# EAGLE design me433_test (EAGLE 8.1.0)
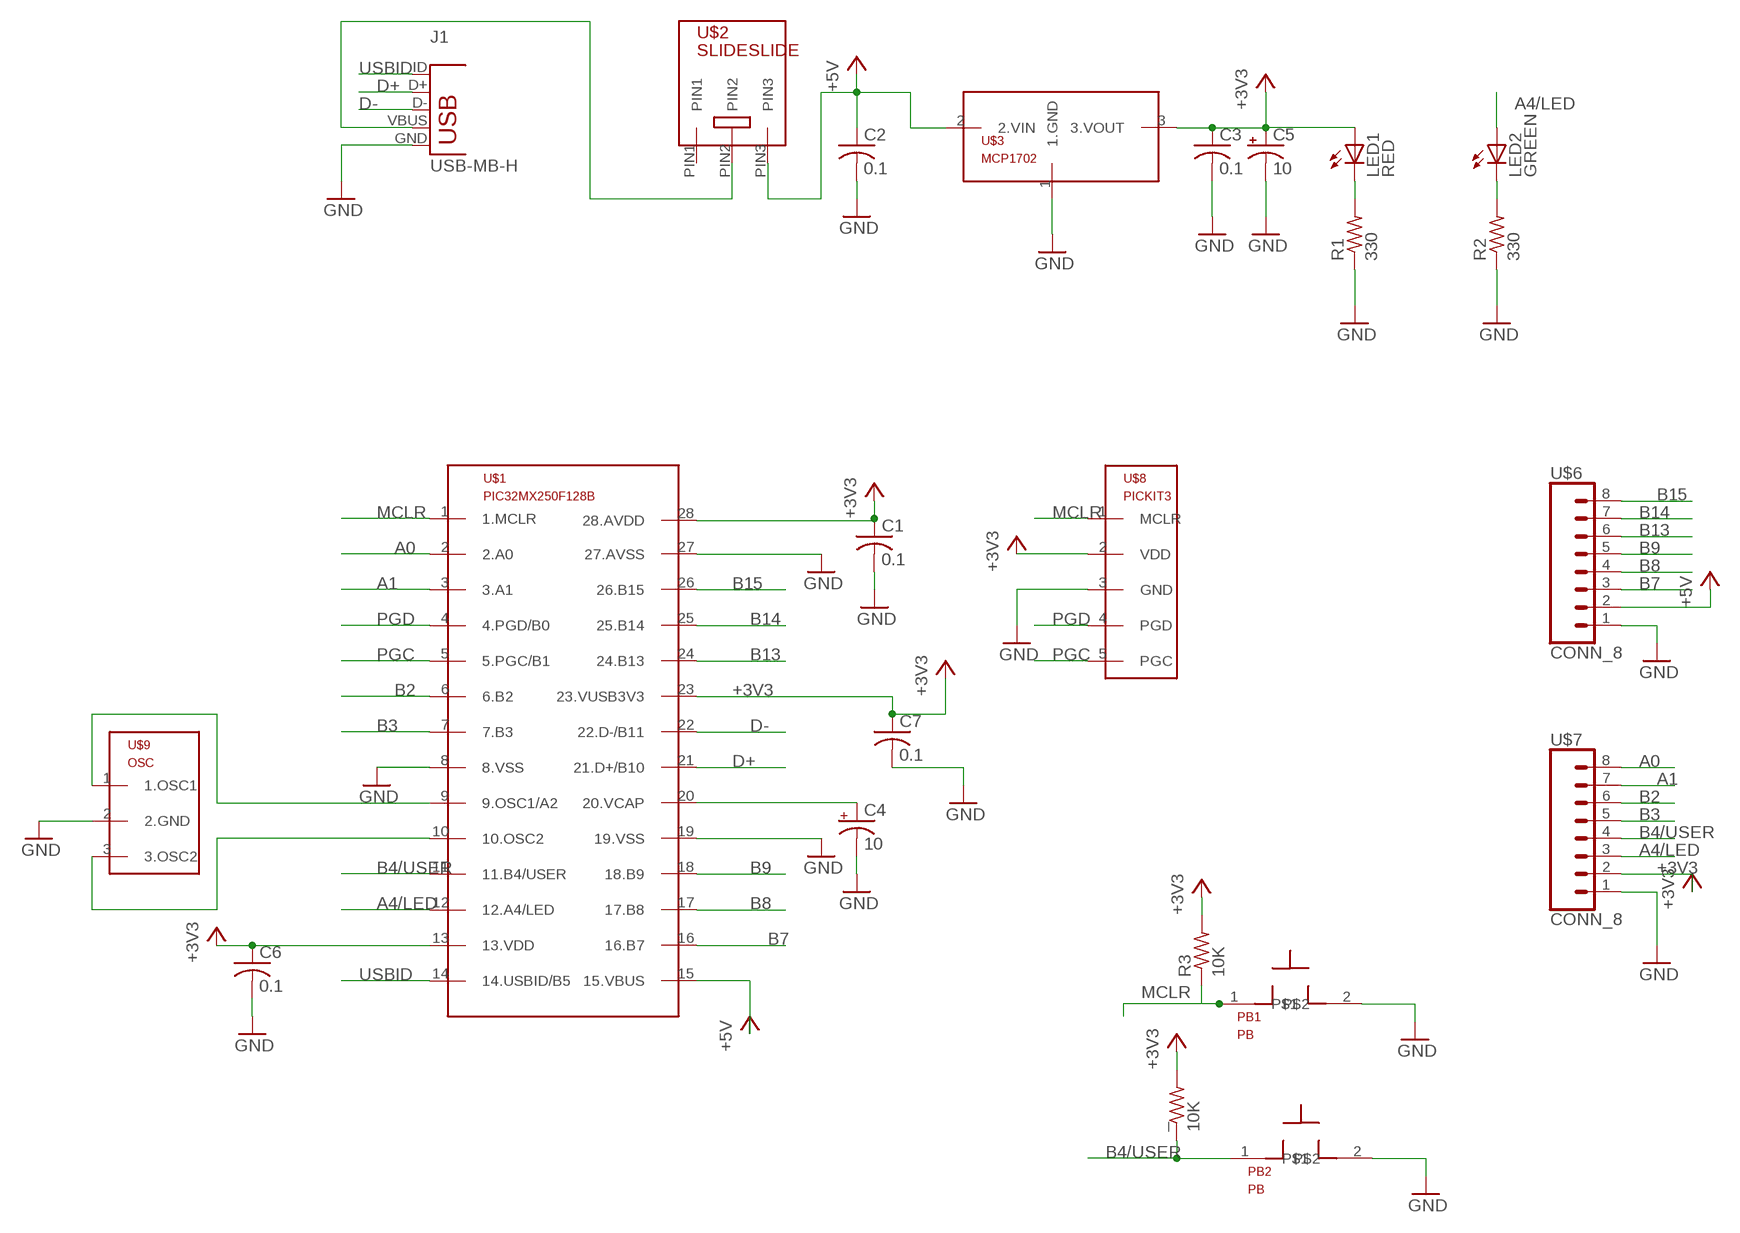
[diagram p0: schematic, sheet 1]

## Parts
_  10K  R-US_0207/10  [0207/10]
C1  0.1  C-US025-025X050  [C025-025X050]
C2  0.1  C-US025-025X050  [C025-025X050]
C3  0.1  C-US025-025X050  [C025-025X050]
C4  10  CPOL-USB45181B  [B45181B]
C5  10  CPOL-USB45181B  [B45181B]
C6  0.1  C-US025-025X050  [C025-025X050]
C7  0.1  C-US025-025X050  [C025-025X050]
J1  USB-MB-H  [USB-MB-H]
LED1  RED  LED3MM  [LED3MM]
LED2  GREEN  LED3MM  [LED3MM]
PB1  PB  [PB]
PB2  PB  [PB]
R1  330  R-US_0207/10  [0207/10]
R2  330  R-US_0207/10  [0207/10]
R3  10K  R-US_0207/10  [0207/10]
U$1  PIC32MX250F128B  [DIL28-3]
U$2  SLIDESLIDE  [SLIDE]
U$3  MCP1702  [TO92]
U$6  CONN_8  [1X08]
U$7  CONN_8  [1X08]
U$8  PICKIT3  [1X05]
U$9  OSC  [OSC]

## Nets
+3V3: _.2 C1.1 C3.1 C5.+ C6.1 C7.1 LED1.A R3.2 U$1.13(13.VDD) U$1.23(23.VUSB3V3) U$1.28(28.AVDD) U$3.3(3.VOUT) U$7.2 U$8.2(VDD)
+5V: C2.1 U$1.15(15.VBUS) U$2.PIN3 U$3.2(2.VIN) U$6.2
A0: U$1.2(2.A0) U$7.8
A1: U$1.3(3.A1) U$7.7
A4/LED: LED2.A U$1.12(12.A4/LED) U$7.3
B2: U$1.6(6.B2) U$7.6
B3: U$1.7(7.B3) U$7.5
B4/USER: _.1 PB2.1 U$1.11(11.B4/USER) U$7.4
B7: U$1.16(16.B7) U$6.3
B8: U$1.17(17.B8) U$6.4
B9: U$1.18(18.B9) U$6.5
B13: U$1.24(24.B13) U$6.6
B14: U$1.25(25.B14) U$6.7
B15: U$1.26(26.B15) U$6.8
D+: J1.D+ U$1.21(21.D+/B10)
D-: J1.D- U$1.22(22.D-/B11)
GND: C1.2 C2.2 C3.2 C4.- C5.- C6.2 C7.2 J1.GND PB1.2 PB2.2 R1.1 R2.1 U$1.8(8.VSS) U$1.19(19.VSS) U$1.27(27.AVSS) U$3.1(1.GND) U$6.1 U$7.1 U$8.3(GND) U$9.2(2.GND)
MCLR: PB1.1 R3.1 U$1.1(1.MCLR) U$8.1(MCLR)
N$1: U$1.9(9.OSC1/A2) U$9.1(1.OSC1)
N$2: U$1.10(10.OSC2) U$9.3(3.OSC2)
N$3: J1.VBUS U$2.PIN2
N$4: C4.+ U$1.20(20.VCAP)
N$6: LED1.K(C) R1.2
N$7: LED2.K(C) R2.2
PGC: U$1.5(5.PGC/B1) U$8.5(PGC)
PGD: U$1.4(4.PGD/B0) U$8.4(PGD)
USBID: J1.ID U$1.14(14.USBID/B5)
Unconnected: U$2.PIN1

## Library data of the parts
_ R1-R3 = me433_lib:R-US_: RESISTOR, American symbol
C1-C3 C6 C7 = me433_lib:C-US: CAPACITOR, American symbol
C4 C5 = me433_lib:CPOL-US: POLARIZED CAPACITOR, American symbol
J1 = me433_lib:USB: USB Connectors USB-B-PTH is fully proven SKU : PRT-00139/CONN-08278 USB-miniB is fully proven SKU : PRT-00587 USB-A-PCB is untested. USB-A-H is throughly reviewed, but untested. Spark Fun Electronics SKU : PRT-00437 USB-B-SMT is throughly reviewed, but untested. Needs silkscreen touching up. USB-A-S has not been used/tested USB-MB-H has not been used/tested USB-MICROB has been used. CONN-09505
LED1 LED2 = led:LED: LED OSRAM: - CHIPLED LG R971, LG N971, LY N971, LG Q971, LY Q971, LO R971, LY R971 LH N974, LH R974 LS Q976, LO Q976, LY Q976 LO Q996 - Hyper CHIPLED LW Q18S LB Q993, LB Q99A, LB R99A - SideLED LS A670, LO A670, LY A670, LG A670, LP A670 LB A673, LV A673, LT A673, LW A673 LH A674 LY A675 LS A676, LA A676, LO A676, LY A676, LW A676 LS A679, LY A679, LG A679 - Hyper Micro SIDELED® LS Y876, LA Y876, LO Y876, LY Y876 LT Y87S - SmartLED LW L88C, LW L88S LB L89C, LB L89S, LG L890 LS L89K, LO L89K, LY L89K LS L896, LA L896, LO L896, LY L896 - TOPLED LS T670, LO T670, LY T670, LG T670, LP T670 LSG T670, LSP T670, LSY T670, LOP T670, LYG T670 LG T671, LOG T671, LSG T671 LB T673, LV T673, LT T673, LW T673 LH T674 LS T676, LA T676, LO T676, LY T676, LB T676, LH T676, LSB T676, LW T676 LB T67C, LV T67C, LT T67C, LS T67K, LO T67K, LY T67K, LW E67C LS E67B, LA E67B, LO E67B, LY E67B, LB E67C, LV E67C, LT E67C LW T67C LS T679, LY T679, LG T679 LS T770, LO T770, LY T770, LG T770, LP T770 LB T773, LV T773, LT T773, LW T773 LH T774 LS E675, LA E675, LY E675, LS T675 LS T776, LA T776, LO T776, LY T776, LB T776 LHGB T686 LT T68C, LB T68C - Hyper Mini TOPLED® LB M676 - Mini TOPLED Santana® LG M470 LS M47K, LO M47K, LY M47K Source: http://www.osram.convergy.de LUXEON: - LUMILED® LXK2-PW12-R00, LXK2-PW12-S00, LXK2-PW14-U00, LXK2-PW14-V00 LXK2-PM12-R00, LXK2-PM12-S00, LXK2-PM14-U00 LXK2-PE12-Q00, LXK2-PE12-R00, LXK2-PE12-S00, LXK2-PE14-T00, LXK2-PE14-U00 LXK2-PB12-K00, LXK2-PB12-L00, LXK2-PB12-M00, LXK2-PB14-N00, LXK2-PB14-P00, LXK2-PB14-Q00 LXK2-PR12-L00, LXK2-PR12-M00, LXK2-PR14-Q00, LXK2-PR14-R00 LXK2-PD12-Q00, LXK2-PD12-R00, LXK2-PD12-S00 LXK2-PH12-R00, LXK2-PH12-S00 LXK2-PL12-P00, LXK2-PL12-Q00, LXK2-PL12-R00 Source: www.luxeon.com KINGBRIGHT: KA-3528ASYC Source: www.kingbright.com
PB1 PB2 = me433_lib:PB
U$1 = me433_lib:PIC32MX250F128B
U$2 = me433_lib:SLIDE
U$3 = me433_lib:MCP1702
U$6 U$7 = me433_lib:CONN_8
U$8 = me433_lib:PICKIT3
U$9 = me433_lib:OSC

## Board
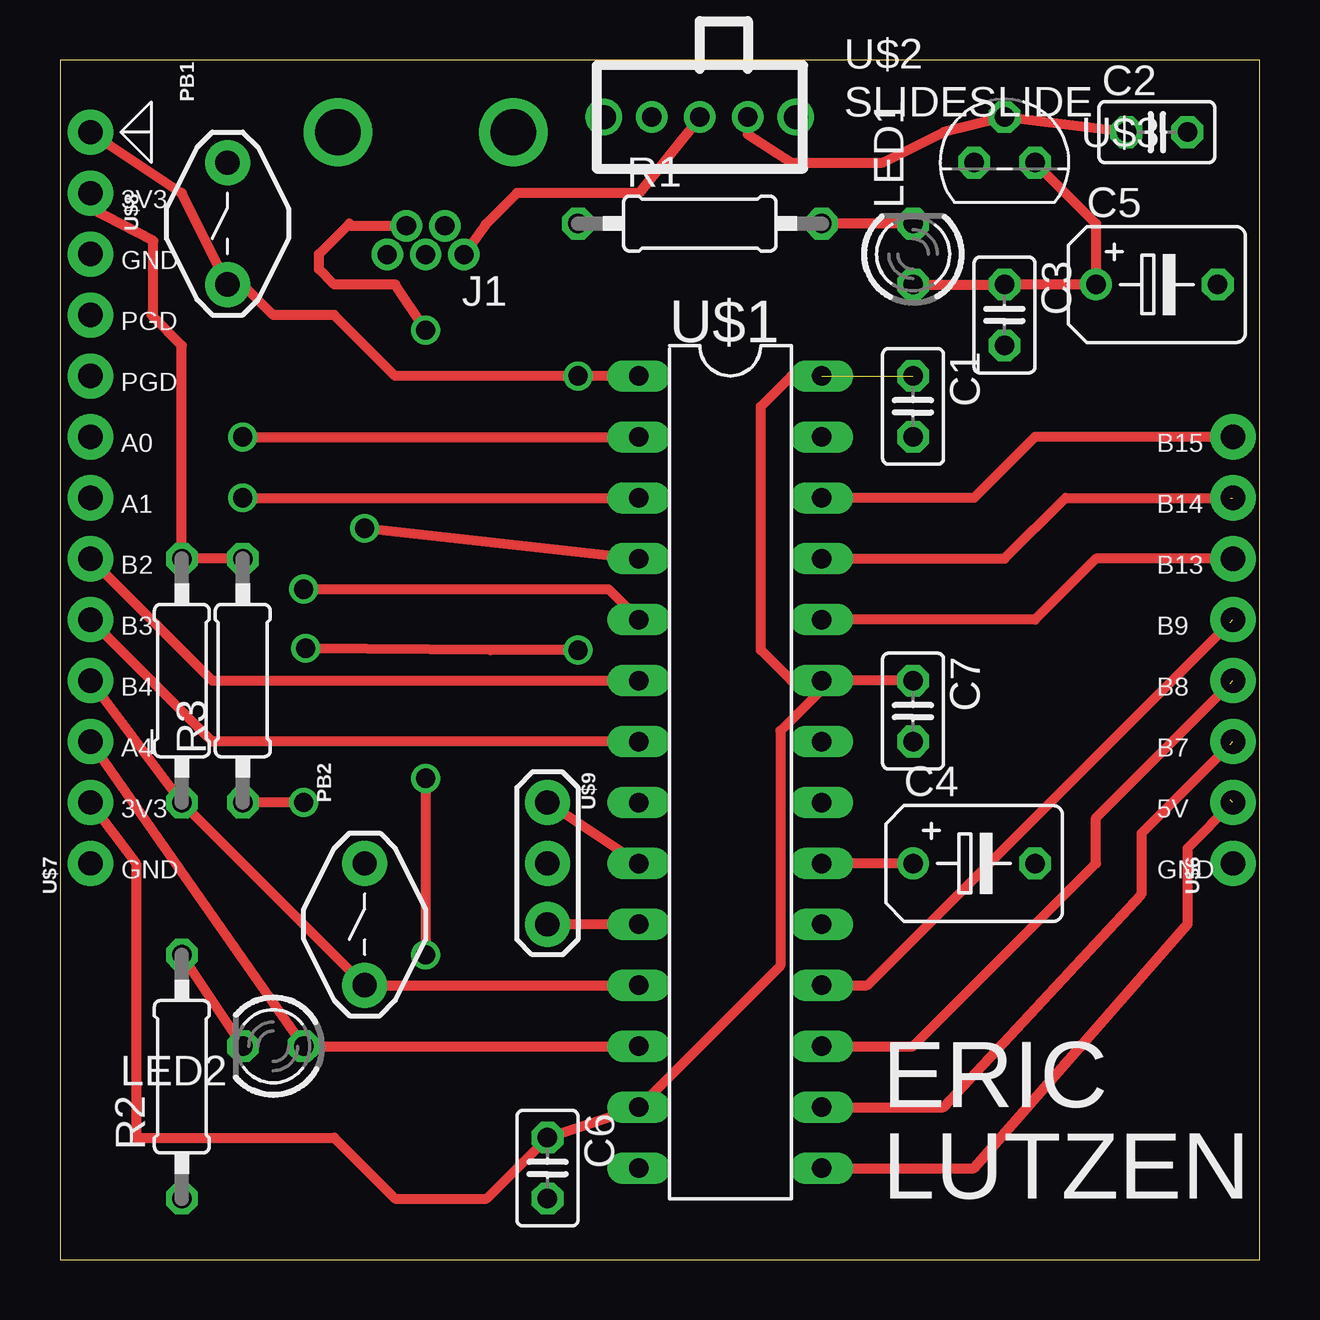
[diagram p1: board, top side]
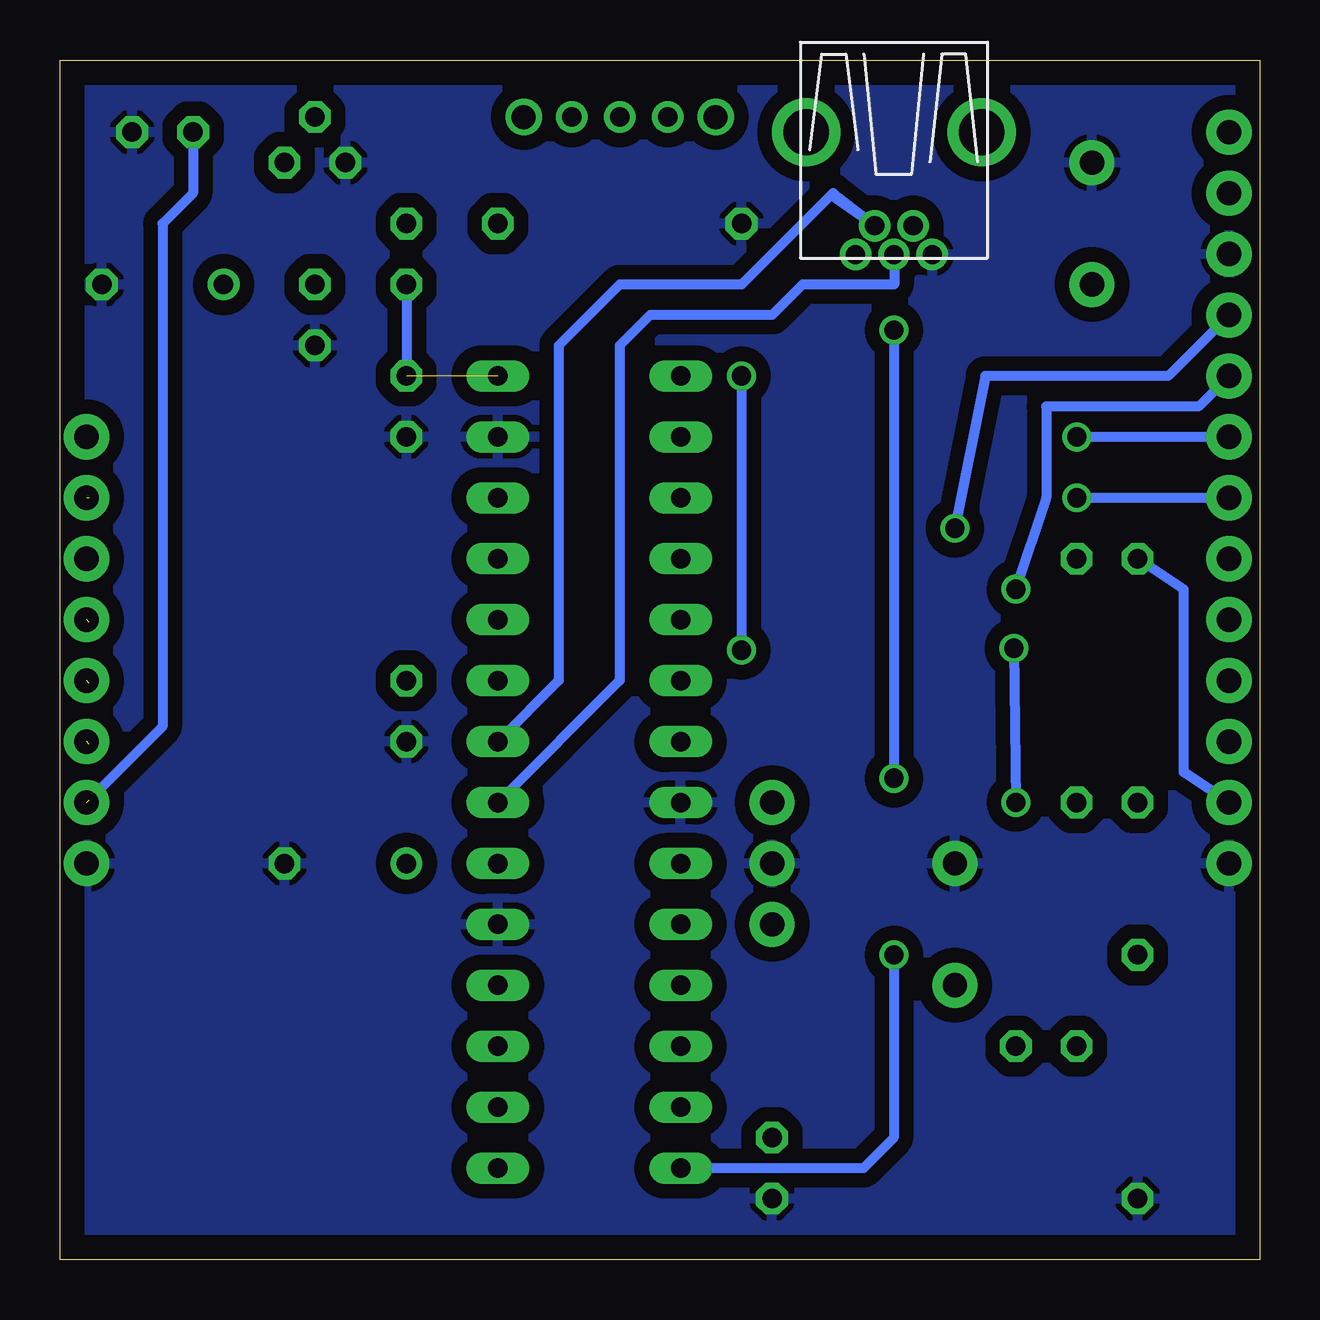
[diagram p2: board, bottom side, seen from below]

Size 50 x 50 mm. Coordinates in mm from the lower left corner, seen from the top.
Outline: 0,0 50,0 50,50 0,50 0,0
Copper layers (1*16): Top 0.035mm / dielectric 1.5mm / Bottom 0.035mm
Design rules "default": minimum track width 10mil, minimum drill 24mil, track to track 8mil, track to pad 8mil, pad to pad 8mil, via to via 8mil, smd to smd 8mil, copper to edge 40mil, drill to drill 8mil, minimum pad ring 10mil, minimum via ring 8mil, stop-mask expansion 4mil, vias tented up to drill 0mil, thermal gap 10mil

### Footprints (pad centres in the part's own frame; a part is rotated, then mirrored left to right if it is on the bottom)
0207/10 = drill 0.813 octagon: 1 -5.08,0; 2 5.08,0
C025-025X050 = drill 0.813 octagon: 1 -1.27,0; 2 1.27,0
B45181B = drill 0.813: + -2.54,0 | drill 0.813 octagon: - 2.54,0
USB-MB-H = drill 0.8: D+ 5.1,0; D- 3.9,0.8; GND 5.1,-1.6; ID 3.9,-0.8; VBUS 5.1,1.6 | drill 1.9: P$6 0,-3.65; P$7 0,3.65
LED3MM = drill 0.813 octagon: A -1.27,0; K 1.27,0
PB = drill 1.016 pad 1.88: 1 -2.54,0; 2 2.54,0
DIL28-3 = drill 0.813 long: 1 -16.51,-3.81; 2 -13.97,-3.81; 3 -11.43,-3.81; 4 -8.89,-3.81; 5 -6.35,-3.81; 6 -3.81,-3.81; 7 -1.27,-3.81; 8 1.27,-3.81; 9 3.81,-3.81; 10 6.35,-3.81; 11 8.89,-3.81; 12 11.43,-3.81; 13 13.97,-3.81; 14 16.51,-3.81; 15 16.51,3.81; 16 13.97,3.81; 17 11.43,3.81; 18 8.89,3.81; 19 6.35,3.81; 20 3.81,3.81; 21 1.27,3.81; 22 -1.27,3.81; 23 -3.81,3.81; 24 -6.35,3.81; 25 -8.89,3.81; 26 -11.43,3.81; 27 -13.97,3.81; 28 -16.51,3.81
SLIDE = drill 1: P$4 -4,0; P$5 4,0 | drill 0.8: PIN1 -2,0; PIN2 0,0; PIN3 2,0
TO92 = drill 0.813 octagon: 1 -1.27,0; 2 0,1.905; 3 1.27,0
1X08 = drill 1.016 pad 1.88: 1 0,0; 2 2.54,0; 3 5.08,0; 4 7.62,0; 5 10.16,0; 6 12.7,0; 7 15.24,0; 8 17.78,0
1X05 = drill 1.016 pad 1.88: 1 0,0; 2 2.54,0; 3 5.08,0; 4 7.62,0; 5 10.16,0
OSC = drill 1.016 pad 1.88: 1 -2.54,0; 2 0,0; 3 2.54,0

### Placement (x,y rotation side)
_  5.08,24.13 90 top
C1  35.56,35.56 270 top
C2  45.72,46.99 0 top
C3  39.37,39.37 270 top
C4  38.1,16.51 0 top
C5  45.72,40.64 0 top
C6  20.32,3.81 270 top
C7  35.56,22.86 270 top
J1  15.24,46.99 270 top
LED1  35.56,41.91 90 top
LED2  8.89,8.89 180 top
PB1  6.99,43.18 90 top
PB2  12.7,13.97 90 top
R1  26.67,43.18 0 top
R2  5.08,7.62 90 top
R3  7.62,24.13 90 top
U$1  27.94,20.32 270 top
U$2  26.67,47.62 0 top
U$3  39.37,45.72 0 top
U$6  48.9,16.51 90 top
U$7  1.27,16.51 90 top
U$8  1.27,46.99 270 top
U$9  20.32,16.51 270 top

### Tracks (layer width: path | path; a pad name or v marks a point on that pad's centre or on a via)
+3V3  (1 unrouted)
  Top 0.406: U$3.3 43.18,43.18 C5.+ C3.1 LED1.A | C7.1 U$1.23 | U$1.28 30.48,36.83 29.21,35.56 29.21,25.4 30.48,24.13 U$1.23 | R3.2 _.2 5.08,38.1 3.89,39.29 | U$7.2 3.17,16.51 3.17,5.08 11.43,5.08 13.97,2.54 17.78,2.54 C6.1 U$1.13 30.02,12.24 30.02,22.03 31.75,23.76 U$1.23 | 3.81,39.37 3.89,39.29 | U$8.2 1.27,43.81 3.89,42.47 3.89,39.29
  Bottom 0.406: LED1.A C1.1 | _.2 3.17,27.94 3.17,20.32 U$7.2
+5V  (1 unrouted)
  Top 0.406: U$2.PIN3 28.67,46.9 30.48,45.72 34.29,45.72 36.83,46.99 U$3.2 C2.1 | U$1.15 38.1,3.81 46.99,13.97 46.99,17.14 U$6.2
  Bottom 0.406: C2.1 44.45,44.45 45.72,43.18 45.72,22.23 48.78,19.16
A0  (via drill 0.8 pad 0.81)
  Top 0.406: v7.62,34.29 U$1.2
  Bottom 0.406: U$7.8 v7.62,34.29
A1  (via drill 0.8 pad 0.81)
  Top 0.406: v7.62,31.75 U$1.3
  Bottom 0.406: U$7.7 v7.62,31.75
A4/LED
  Top 0.406: U$1.12 LED2.A U$7.3
B2
  Top 0.406: U$7.6 6.35,24.13 U$1.6
B3
  Top 0.406: U$7.5 6.35,21.59 U$1.7
B4/USER
  Top 0.406: U$7.4 _.1 PB2.1 U$1.11
B7  (1 unrouted)
  Top 0.406: U$1.16 36.83,6.35 45.09,15.24 45.09,17.78 48.78,21.48
B8  (1 unrouted)
  Top 0.406: U$1.17 35.56,8.89 43.18,16.51 43.18,18.41 48.78,24.02
B9  (1 unrouted)
  Top 0.406: U$1.18 33.66,11.43 48.78,26.56
B13
  Top 0.406: U$6.6 43.18,29.21 40.64,26.67 U$1.24
B14  (1 unrouted)
  Top 0.406: U$1.25 39.37,29.21 41.91,31.75 48.78,31.75
B15
  Top 0.406: U$6.8 40.64,34.29 38.1,31.75 U$1.26
D+
  Bottom 0.406: U$1.21 26.67,24.13 26.67,38.1 25.4,39.37 20.32,39.37 19.05,40.64 15.22,40.64 J1.D+
D-
  Bottom 0.406: 17.78,44.45 J1.D- 17.87,44.36 21.59,40.64 26.67,40.64 29.21,38.1 29.21,24.13 U$1.22
GND
  pour Bottom (isolate 0.61): 0,0 49.53,0 49.53,50.8 0,50
MCLR  (via drill 0.8 pad 0.81)
  Top 0.406: U$8.1 5.08,44.45 PB1.1 7.62,40.64 8.89,39.37 11.43,39.37 13.97,36.83 v21.59,36.83 U$1.1 | v21.59,25.4 17.94,25.4 v10.24,25.48 | v10.16,19.05 R3.1
  Bottom 0.406: v21.59,36.83 v21.59,25.4 | v10.24,25.48 v10.16,19.05
N$1
  Top 0.406: U$1.9 U$9.1
N$2
  Top 0.406: U$1.10 U$9.3
N$3
  Top 0.406: U$2.PIN2 24.13,44.45 19.05,44.45 17.76,43.16 J1.VBUS
N$4
  Top 0.406: C4.+ U$1.20
N$6
  Top 0.406: LED1.K R1.2
N$7
  Top 0.406: LED2.K R2.2
PGC  (via drill 0.8 pad 0.81)
  Top 0.406: v10.16,27.94 22.86,27.94 U$1.5
  Bottom 0.406: v10.16,27.94 8.89,31.75 8.89,35.56 2.54,35.56 U$8.5
PGD  (via drill 0.8 pad 0.81)
  Top 0.406: v12.7,30.48 U$1.4
  Bottom 0.406: v12.7,30.48 11.43,36.83 3.81,36.83 U$8.4
USBID  (via drill 0.8 pad 0.81)
  Top 0.406: v15.24,38.73 13.97,40.64 12.7,40.64 11.43,40.64 10.79,41.27 10.79,41.91 12.06,43.18 12.15,43.09 J1.ID | v15.24,20.06 v15.24,12.7
  Bottom 0.406: U$1.14 16.51,3.81 15.24,5.08 v15.24,12.7 | v15.24,38.73 v15.24,20.06

### Text on the board
tSilk: 3V3
_tsilk: GND | PGD | PGD | A0 | B15 | A1 | B14 | B2 | B13 | B3 | B9 | B4 | B8 | A4 | B7 | 3V3 | 5V | GND | GND | ERIC | LUTZEN